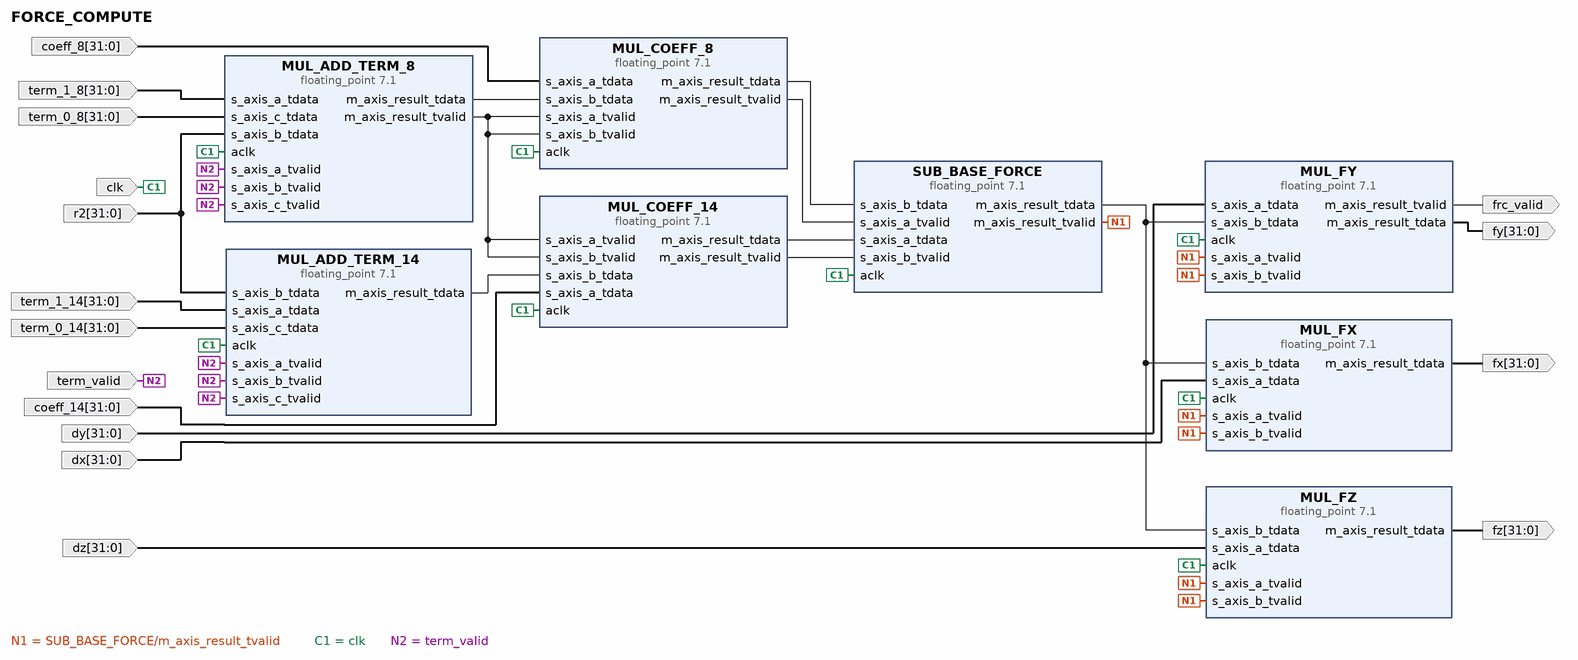
[diagram p0: block diagram of the top level]
# Vivado block design FORCE_COMPUTE, xcu280-fsvh2892-2L-e, Vivado 2021.2
create_bd_design FORCE_COMPUTE

create_bd_port -dir I -type clk clk
set_property -dict {CONFIG.FREQ_HZ 10000000} [get_bd_ports clk]
create_bd_port -dir I -from 31 -to 0 coeff_8
create_bd_port -dir I -from 31 -to 0 coeff_14
create_bd_port -dir I -from 31 -to 0 -type data dx
create_bd_port -dir I -from 31 -to 0 -type data dy
create_bd_port -dir I -from 31 -to 0 -type data dz
create_bd_port -dir O frc_valid
create_bd_port -dir O -from 31 -to 0 fx
create_bd_port -dir O -from 31 -to 0 fy
create_bd_port -dir O -from 31 -to 0 fz
create_bd_port -dir I -from 31 -to 0 r2
create_bd_port -dir I -from 31 -to 0 term_0_8
create_bd_port -dir I -from 31 -to 0 term_0_14
create_bd_port -dir I -from 31 -to 0 term_1_8
create_bd_port -dir I -from 31 -to 0 term_1_14
create_bd_port -dir I term_valid

create_bd_cell -type ip -vlnv xilinx.com:ip:floating_point:7.1 MUL_ADD_TERM_8
set_property -dict [list \
  CONFIG.Add_Sub_Value Add \
  CONFIG.C_Latency 5 \
  CONFIG.C_Mult_Usage Medium_Usage \
  CONFIG.C_Rate 1 \
  CONFIG.C_Result_Exponent_Width 8 \
  CONFIG.C_Result_Fraction_Width 24 \
  CONFIG.Flow_Control NonBlocking \
  CONFIG.Has_RESULT_TREADY false \
  CONFIG.Maximum_Latency false \
  CONFIG.Operation_Type FMA \
  CONFIG.Result_Precision_Type Single \
] [get_bd_cells MUL_ADD_TERM_8]
create_bd_cell -type ip -vlnv xilinx.com:ip:floating_point:7.1 MUL_ADD_TERM_14
set_property -dict [list \
  CONFIG.Add_Sub_Value Add \
  CONFIG.C_Latency 5 \
  CONFIG.C_Mult_Usage Medium_Usage \
  CONFIG.C_Rate 1 \
  CONFIG.C_Result_Exponent_Width 8 \
  CONFIG.C_Result_Fraction_Width 24 \
  CONFIG.Flow_Control NonBlocking \
  CONFIG.Has_RESULT_TREADY false \
  CONFIG.Maximum_Latency false \
  CONFIG.Operation_Type FMA \
  CONFIG.Result_Precision_Type Single \
] [get_bd_cells MUL_ADD_TERM_14]
create_bd_cell -type ip -vlnv xilinx.com:ip:floating_point:7.1 MUL_COEFF_8
set_property -dict [list \
  CONFIG.C_Latency 4 \
  CONFIG.C_Mult_Usage Full_Usage \
  CONFIG.C_Rate 1 \
  CONFIG.C_Result_Exponent_Width 8 \
  CONFIG.C_Result_Fraction_Width 24 \
  CONFIG.Flow_Control NonBlocking \
  CONFIG.Has_RESULT_TREADY false \
  CONFIG.Maximum_Latency false \
  CONFIG.Operation_Type Multiply \
  CONFIG.Result_Precision_Type Single \
] [get_bd_cells MUL_COEFF_8]
create_bd_cell -type ip -vlnv xilinx.com:ip:floating_point:7.1 MUL_COEFF_14
set_property -dict [list \
  CONFIG.C_Latency 4 \
  CONFIG.C_Mult_Usage Full_Usage \
  CONFIG.C_Rate 1 \
  CONFIG.C_Result_Exponent_Width 8 \
  CONFIG.C_Result_Fraction_Width 24 \
  CONFIG.Flow_Control NonBlocking \
  CONFIG.Has_RESULT_TREADY false \
  CONFIG.Maximum_Latency false \
  CONFIG.Operation_Type Multiply \
  CONFIG.Result_Precision_Type Single \
] [get_bd_cells MUL_COEFF_14]
create_bd_cell -type ip -vlnv xilinx.com:ip:floating_point:7.1 MUL_FX
set_property -dict [list \
  CONFIG.C_Latency 4 \
  CONFIG.C_Mult_Usage Full_Usage \
  CONFIG.C_Rate 1 \
  CONFIG.C_Result_Exponent_Width 8 \
  CONFIG.C_Result_Fraction_Width 24 \
  CONFIG.Flow_Control NonBlocking \
  CONFIG.Has_RESULT_TREADY false \
  CONFIG.Maximum_Latency false \
  CONFIG.Operation_Type Multiply \
  CONFIG.Result_Precision_Type Single \
] [get_bd_cells MUL_FX]
create_bd_cell -type ip -vlnv xilinx.com:ip:floating_point:7.1 MUL_FY
set_property -dict [list \
  CONFIG.C_Latency 4 \
  CONFIG.C_Mult_Usage Full_Usage \
  CONFIG.C_Rate 1 \
  CONFIG.C_Result_Exponent_Width 8 \
  CONFIG.C_Result_Fraction_Width 24 \
  CONFIG.Flow_Control NonBlocking \
  CONFIG.Has_RESULT_TREADY false \
  CONFIG.Maximum_Latency false \
  CONFIG.Operation_Type Multiply \
  CONFIG.Result_Precision_Type Single \
] [get_bd_cells MUL_FY]
create_bd_cell -type ip -vlnv xilinx.com:ip:floating_point:7.1 MUL_FZ
set_property -dict [list \
  CONFIG.C_Latency 4 \
  CONFIG.C_Mult_Usage Full_Usage \
  CONFIG.C_Rate 1 \
  CONFIG.C_Result_Exponent_Width 8 \
  CONFIG.C_Result_Fraction_Width 24 \
  CONFIG.Flow_Control NonBlocking \
  CONFIG.Has_RESULT_TREADY false \
  CONFIG.Maximum_Latency false \
  CONFIG.Operation_Type Multiply \
  CONFIG.Result_Precision_Type Single \
] [get_bd_cells MUL_FZ]
create_bd_cell -type ip -vlnv xilinx.com:ip:floating_point:7.1 SUB_BASE_FORCE
set_property -dict [list \
  CONFIG.Add_Sub_Value Subtract \
  CONFIG.C_Latency 3 \
  CONFIG.Flow_Control NonBlocking \
  CONFIG.Has_RESULT_TREADY false \
  CONFIG.Maximum_Latency false \
] [get_bd_cells SUB_BASE_FORCE]

# ---- connections ----

connect_bd_net [get_bd_pins MUL_ADD_TERM_14/m_axis_result_tdata] [get_bd_pins MUL_COEFF_14/s_axis_b_tdata]
connect_bd_net [get_bd_pins MUL_ADD_TERM_8/m_axis_result_tdata] [get_bd_pins MUL_COEFF_8/s_axis_b_tdata]
connect_bd_net [get_bd_pins MUL_ADD_TERM_8/m_axis_result_tvalid] \
  [get_bd_pins MUL_COEFF_14/s_axis_a_tvalid] [get_bd_pins MUL_COEFF_14/s_axis_b_tvalid] \
  [get_bd_pins MUL_COEFF_8/s_axis_a_tvalid] [get_bd_pins MUL_COEFF_8/s_axis_b_tvalid]
connect_bd_net [get_bd_pins MUL_COEFF_14/m_axis_result_tdata] [get_bd_pins SUB_BASE_FORCE/s_axis_a_tdata]
connect_bd_net [get_bd_pins MUL_COEFF_14/m_axis_result_tvalid] [get_bd_pins SUB_BASE_FORCE/s_axis_b_tvalid]
connect_bd_net [get_bd_pins MUL_COEFF_8/m_axis_result_tdata] [get_bd_pins SUB_BASE_FORCE/s_axis_b_tdata]
connect_bd_net [get_bd_pins MUL_COEFF_8/m_axis_result_tvalid] [get_bd_pins SUB_BASE_FORCE/s_axis_a_tvalid]
connect_bd_net -net MUL_FX1_m_axis_result_tdata [get_bd_pins MUL_FY/m_axis_result_tdata] [get_bd_ports fy]
connect_bd_net -net MUL_FX2_m_axis_result_tdata [get_bd_pins MUL_FZ/m_axis_result_tdata] [get_bd_ports fz]
connect_bd_net [get_bd_pins MUL_FX/m_axis_result_tdata] [get_bd_ports fx]
connect_bd_net [get_bd_pins MUL_FY/m_axis_result_tvalid] [get_bd_ports frc_valid]
connect_bd_net [get_bd_pins SUB_BASE_FORCE/m_axis_result_tdata] \
  [get_bd_pins MUL_FX/s_axis_b_tdata] [get_bd_pins MUL_FY/s_axis_b_tdata] [get_bd_pins MUL_FZ/s_axis_b_tdata]
connect_bd_net [get_bd_pins SUB_BASE_FORCE/m_axis_result_tvalid] \
  [get_bd_pins MUL_FX/s_axis_a_tvalid] [get_bd_pins MUL_FX/s_axis_b_tvalid] [get_bd_pins MUL_FY/s_axis_a_tvalid] \
  [get_bd_pins MUL_FY/s_axis_b_tvalid] [get_bd_pins MUL_FZ/s_axis_a_tvalid] [get_bd_pins MUL_FZ/s_axis_b_tvalid]
connect_bd_net -net aclk_0_1 [get_bd_ports clk] \
  [get_bd_pins MUL_ADD_TERM_14/aclk] [get_bd_pins MUL_ADD_TERM_8/aclk] [get_bd_pins MUL_COEFF_14/aclk] \
  [get_bd_pins MUL_COEFF_8/aclk] [get_bd_pins MUL_FX/aclk] [get_bd_pins MUL_FY/aclk] [get_bd_pins MUL_FZ/aclk] \
  [get_bd_pins SUB_BASE_FORCE/aclk]
connect_bd_net [get_bd_ports dx] [get_bd_pins MUL_FX/s_axis_a_tdata]
connect_bd_net [get_bd_ports dy] [get_bd_pins MUL_FY/s_axis_a_tdata]
connect_bd_net [get_bd_ports dz] [get_bd_pins MUL_FZ/s_axis_a_tdata]
connect_bd_net -net s_axis_a_tdata_0_1 [get_bd_ports term_1_14] [get_bd_pins MUL_ADD_TERM_14/s_axis_a_tdata]
connect_bd_net -net s_axis_a_tdata_0_2 [get_bd_ports coeff_8] [get_bd_pins MUL_COEFF_8/s_axis_a_tdata]
connect_bd_net -net s_axis_a_tdata_0_3 [get_bd_ports coeff_14] [get_bd_pins MUL_COEFF_14/s_axis_a_tdata]
connect_bd_net -net s_axis_a_tdata_1_1 [get_bd_ports term_1_8] [get_bd_pins MUL_ADD_TERM_8/s_axis_a_tdata]
connect_bd_net -net s_axis_a_tvalid_0_1 [get_bd_ports term_valid] \
  [get_bd_pins MUL_ADD_TERM_14/s_axis_a_tvalid] [get_bd_pins MUL_ADD_TERM_14/s_axis_b_tvalid] \
  [get_bd_pins MUL_ADD_TERM_14/s_axis_c_tvalid] [get_bd_pins MUL_ADD_TERM_8/s_axis_a_tvalid] \
  [get_bd_pins MUL_ADD_TERM_8/s_axis_b_tvalid] [get_bd_pins MUL_ADD_TERM_8/s_axis_c_tvalid]
connect_bd_net -net s_axis_b_tdata_0_1 [get_bd_ports r2] [get_bd_pins MUL_ADD_TERM_14/s_axis_b_tdata] [get_bd_pins MUL_ADD_TERM_8/s_axis_b_tdata]
connect_bd_net -net s_axis_c_tdata_0_1 [get_bd_ports term_0_8] [get_bd_pins MUL_ADD_TERM_8/s_axis_c_tdata]
connect_bd_net -net s_axis_c_tdata_1_1 [get_bd_ports term_0_14] [get_bd_pins MUL_ADD_TERM_14/s_axis_c_tdata]

validate_bd_design
save_bd_design
